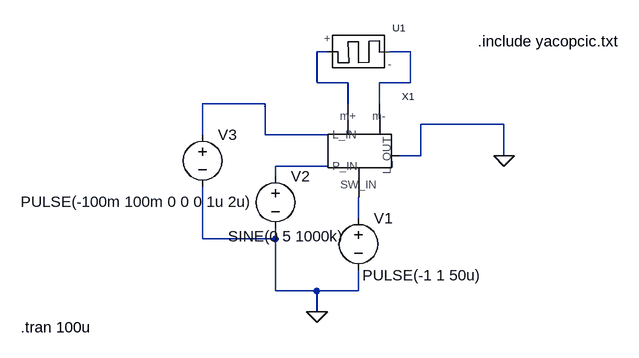
[diagram p0: schematic Switchboxckeck.asc]
Switchboxckeck.asc, the LTspice schematic file:
Version 4
SHEET 1 880 680
WIRE 128 0 112 0
WIRE 256 0 224 0
WIRE 112 48 112 0
WIRE 160 48 112 48
WIRE 256 48 256 0
WIRE 256 48 208 48
WIRE 32 80 -64 80
WIRE 160 80 160 48
WIRE 208 80 208 48
WIRE 400 112 272 112
WIRE -64 128 -64 80
WIRE 32 128 32 80
WIRE 128 128 32 128
WIRE 272 160 272 112
WIRE 272 160 240 160
WIRE 400 160 400 112
WIRE 128 176 48 176
WIRE 48 192 48 176
WIRE 176 256 176 224
WIRE -64 288 -64 208
WIRE 48 288 48 272
WIRE 48 288 -64 288
WIRE 48 368 48 288
WIRE 112 368 48 368
WIRE 176 368 176 336
WIRE 176 368 112 368
WIRE 112 400 112 368
FLAG 112 400 0
FLAG 400 160 0
SYMBOL memristormodel 208 0 R0
SYMATTR InstName U1
SYMATTR Value MEM_YAKOPCIC
SYMBOL voltage 176 240 R0
WINDOW 3 6 104 Left 2
WINDOW 123 0 0 Left 2
WINDOW 39 0 0 Left 2
SYMATTR Value PULSE(-1 1 50u)
SYMATTR InstName V1
SYMBOL voltage 48 176 R0
WINDOW 3 -73 108 Left 2
WINDOW 123 0 0 Left 2
WINDOW 39 0 0 Left 2
SYMATTR Value SINE(0 5 1000k)
SYMATTR InstName V2
SYMBOL voltage -64 112 R0
WINDOW 3 -280 119 Left 2
WINDOW 123 0 0 Left 2
WINDOW 39 0 0 Left 2
SYMATTR Value PULSE(-100m 100m 0 0 0 1u 2u)
SYMATTR InstName V3
SYMBOL Switchboxsymbol 128 160 R0
SYMATTR InstName X1
TEXT -344 424 Left 2 !.tran 100u
TEXT 360 -16 Left 2 !.include yacopcic.txt

The netlist it stands for:
* Switchboxckeck.asc
XU1 N001 N002 M MEM_YAKOPCIC  ; pins + -
V1 N005 0 PULSE(-1 1 50u)
V2 N004 0 SINE(0 5 1000k)
V3 N003 0 PULSE(-100m 100m 0 0 0 1u 2u)
S§X1 N003 N004 0 N001 N002 N005
.tran 100u
.include yacopcic.txt
.backanno
.end